# EAGLE schematic Capacitive (EAGLE 7.2.0)
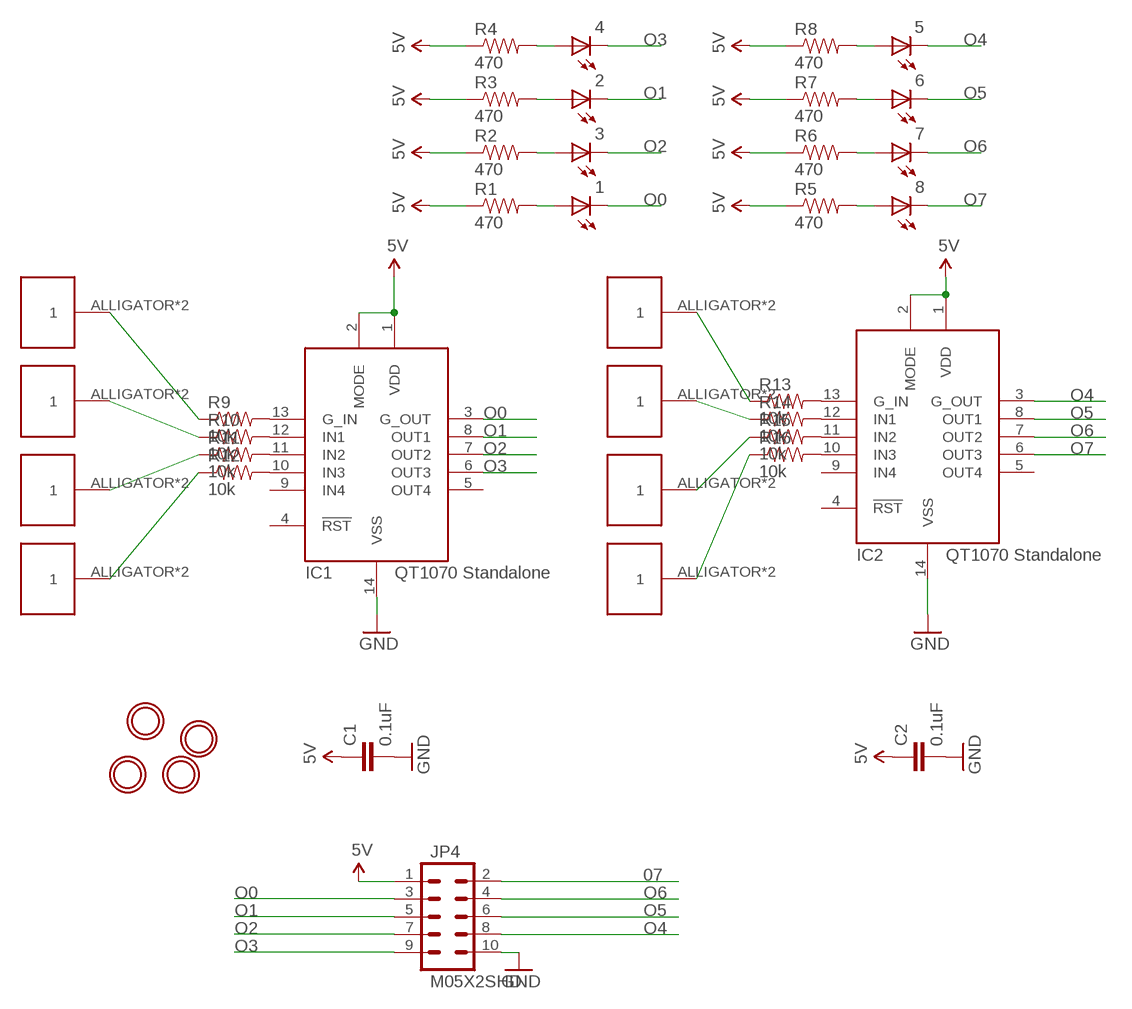
[diagram p0: schematic, sheet 1]

## Parts
1  LEDCHIPLED_0805  [CHIPLED_0805]
2  LEDCHIPLED_0805  [CHIPLED_0805]
3  LEDCHIPLED_0805  [CHIPLED_0805]
4  LEDCHIPLED_0805  [CHIPLED_0805]
5  LEDCHIPLED_0805  [CHIPLED_0805]
6  LEDCHIPLED_0805  [CHIPLED_0805]
7  LEDCHIPLED_0805  [CHIPLED_0805]
8  LEDCHIPLED_0805  [CHIPLED_0805]
C1  0.1uF  CAP0805  [0805]
C2  0.1uF  CAP0805  [0805]
IC1  AT42QT1070  AT42QT1070-SSU  [SO14]
IC2  AT42QT1070  AT42QT1070-SSU  [SO14]
JP4  M05X2SHD  [2X5-SHROUDED]
R1  470  RESISTOR0805-RES  [0805]
R2  470  RESISTOR0805-RES  [0805]
R3  470  RESISTOR0805-RES  [0805]
R4  470  RESISTOR0805-RES  [0805]
R5  470  RESISTOR0805-RES  [0805]
R6  470  RESISTOR0805-RES  [0805]
R7  470  RESISTOR0805-RES  [0805]
R8  470  RESISTOR0805-RES  [0805]
R9  10k  RESISTOR0805-RES  [0805]
R10  10k  RESISTOR0805-RES  [0805]
R11  10k  RESISTOR0805-RES  [0805]
R12  10k  RESISTOR0805-RES  [0805]
R13  10k  RESISTOR0805-RES  [0805]
R14  10k  RESISTOR0805-RES  [0805]
R15  10k  RESISTOR0805-RES  [0805]
R16  10k  RESISTOR0805-RES  [0805]
U$1  ALLIGATOR_CONN  [3MM_ALLIGATOR]
U$2  ALLIGATOR_CONN  [3MM_ALLIGATOR]
U$3  ALLIGATOR_CONN  [3MM_ALLIGATOR]
U$4  ALLIGATOR_CONN  [3MM_ALLIGATOR]
U$5  ALLIGATOR_CONN  [3MM_ALLIGATOR]
U$6  ALLIGATOR_CONN  [3MM_ALLIGATOR]
U$7  ALLIGATOR_CONN  [3MM_ALLIGATOR]
U$8  ALLIGATOR_CONN  [3MM_ALLIGATOR]
U$9  MOUNTINGHOLE2.0  [MOUNTINGHOLE_2.0_PLATED]
U$10  MOUNTINGHOLE2.0  [MOUNTINGHOLE_2.0_PLATED]
U$11  MOUNTINGHOLE2.0  [MOUNTINGHOLE_2.0_PLATED]
U$12  MOUNTINGHOLE2.0  [MOUNTINGHOLE_2.0_PLATED]

## Nets
5V: C1.1 C2.1 IC1.1(VDD) IC1.2(MODE) IC2.1(VDD) IC2.2(MODE) JP4.1 R1.1 R2.1 R3.1 R4.1 R5.1 R6.1 R7.1 R8.1
07: JP4.2
GND [vcc]: C1.2 C2.2 IC1.14(VSS) IC2.14(VSS) JP4.10
N$1: 1.A R1.2
N$2: 3.A R2.2
N$3: 2.A R3.2
N$4: 4.A R4.2
N$5: 8.A R5.2
N$6: 7.A R6.2
N$7: 6.A R7.2
N$8: 5.A R8.2
N$9: IC1.13(G_IN) R9.2
N$10: IC1.12(IN1) R10.2
N$11: IC1.11(IN2) R11.2
N$12: IC1.10(IN3) R12.2
N$13: R12.1 U$4.ALLIGATOR U$4.ALLIGATOR1
N$14: R11.1 U$3.ALLIGATOR U$3.ALLIGATOR1
N$15: R10.1 U$2.ALLIGATOR U$2.ALLIGATOR1
N$16: R9.1 U$1.ALLIGATOR U$1.ALLIGATOR1
N$17: IC2.13(G_IN) R13.2
N$18: IC2.12(IN1) R14.2
N$19: IC2.11(IN2) R15.2
N$20: IC2.10(IN3) R16.2
N$21: R14.1 U$6.ALLIGATOR U$6.ALLIGATOR1
N$22: R15.1 U$7.ALLIGATOR U$7.ALLIGATOR1
N$23: R16.1 U$8.ALLIGATOR U$8.ALLIGATOR1
N$24: R13.1 U$5.ALLIGATOR U$5.ALLIGATOR1
O0: 1.C IC1.3(G_OUT) JP4.3
O1: 2.C IC1.8(OUT1) JP4.5
O2: 3.C IC1.7(OUT2) JP4.7
O3: 4.C IC1.6(OUT3) JP4.9
O4: 5.C IC2.3(G_OUT) JP4.8
O5: 6.C IC2.8(OUT1) JP4.6
O6: 7.C IC2.7(OUT2) JP4.4
O7: 8.C IC2.6(OUT3)
Unconnected: IC1.4(!RST) IC1.5(OUT4) IC1.9(IN4) IC2.4(!RST) IC2.5(OUT4) IC2.9(IN4)

## Library data of the parts
1-8 = adafruit:LED: LED OSRAM: - CHIPLED LG R971, LG N971, LY N971, LG Q971, LY Q971, LO R971, LY R971 LH N974, LH R974 LS Q976, LO Q976, LY Q976 LO Q996 - Hyper CHIPLED LW Q18S LB Q993, LB Q99A, LB R99A - SideLED LS A670, LO A670, LY A670, LG A670, LP A670 LB A673, LV A673, LT A673, LW A673 LH A674 LY A675 LS A676, LA A676, LO A676, LY A676, LW A676 LS A679, LY A679, LG A679 - Hyper Micro SIDELED® LS Y876, LA Y876, LO Y876, LY Y876 LT Y87S - SmartLED LW L88C, LW L88S LB L89C, LB L89S, LG L890 LS L89K, LO L89K, LY L89K LS L896, LA L896, LO L896, LY L896 - TOPLED LS T670, LO T670, LY T670, LG T670, LP T670 LSG T670, LSP T670, LSY T670, LOP T670, LYG T670 LG T671, LOG T671, LSG T671 LB T673, LV T673, LT T673, LW T673 LH T674 LS T676, LA T676, LO T676, LY T676, LB T676, LH T676, LSB T676, LW T676 LB T67C, LV T67C, LT T67C, LS T67K, LO T67K, LY T67K, LW E67C LS E67B, LA E67B, LO E67B, LY E67B, LB E67C, LV E67C, LT E67C LW T67C LS T679, LY T679, LG T679 LS T770, LO T770, LY T770, LG T770, LP T770 LB T773, LV T773, LT T773, LW T773 LH T774 LS E675, LA E675, LY E675, LS T675 LS T776, LA T776, LO T776, LY T776, LB T776 LHGB T686 LT T68C, LB T68C - Hyper Mini TOPLED® LB M676 - Mini TOPLED Santana® LG M470 LS M47K, LO M47K, LY M47K Source: http://www.osram.convergy.de/
C1 C2 = SparkFun-Passives:CAP: Capacitor Standard 0603 ceramic capacitor, and 0.1" leaded capacitor.
IC1 IC2 = adafruit:AT42QT1070: QTouch 5-channel standalone sensor IC AT42QT1070 in standalone mode has 5 inputs (guard + 4 key) and open drain outputs. 1.8V-5.5V power.
JP4 = SparkFun-Connectors:M05X2: Header 5x2 Standard 10-pin dual row 0.1" header. Commonly used with AVR-ISP. Use with Spark Fun Electronics SKU: PRT-00778
R1-R16 = SparkFun-Resistors:RESISTOR: Resistor Basic schematic elements and footprints for 0603, 1206, and PTH resistors.
U$1-U$8 = digikey:ALLIGATOR_CONN
U$9-U$12 = microbuilder:MOUNTINGHOLE: Mounting Hole For #2 screws (0.086"/2.18mm width, 0.094"/2.4mm hole) use 2.5mm; BOM: EXCLUDE

## Net classes
0 default: width 0.203 mm
1 vcc: width 0.254 mm